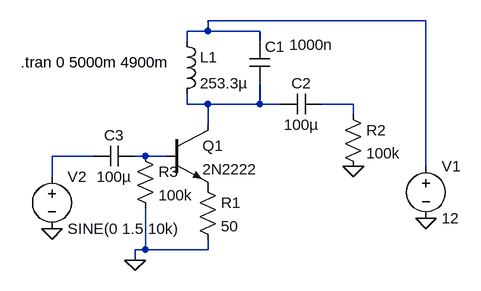
[diagram p0: schematic claseC.asc]
claseC.asc, the LTspice schematic file:
Version 4
SHEET 1 880 680
WIRE 560 -16 224 -16
WIRE 224 0 224 -16
WIRE 224 0 192 0
WIRE 304 0 224 0
WIRE 192 16 192 0
WIRE 304 16 304 0
WIRE 192 112 192 96
WIRE 224 112 192 112
WIRE 304 112 304 80
WIRE 304 112 224 112
WIRE 336 112 304 112
WIRE 448 112 400 112
WIRE 448 128 448 112
WIRE 224 144 224 112
WIRE 48 192 -16 192
WIRE 128 192 112 192
WIRE 160 192 128 192
WIRE 560 208 560 -16
WIRE -16 224 -16 192
WIRE 128 336 128 272
WIRE 128 336 112 336
WIRE 224 336 224 320
WIRE 224 336 128 336
WIRE 112 352 112 336
FLAG 112 352 0
FLAG 560 288 0
FLAG 448 208 0
FLAG -16 304 0
DATAFLAG 320 112 ""
SYMBOL npn 160 144 R0
SYMATTR InstName Q1
SYMATTR Value 2N2222
SYMBOL voltage 560 192 R0
WINDOW 123 0 0 Left 0
WINDOW 39 0 0 Left 0
SYMATTR InstName V1
SYMATTR Value 12
SYMBOL ind 176 0 R0
SYMATTR InstName L1
SYMATTR Value 253.3µ
SYMBOL cap 288 16 R0
WINDOW 3 62 5 Left 2
SYMATTR Value 1000n
SYMATTR InstName C1
SYMBOL cap 400 96 R90
WINDOW 0 0 32 VBottom 2
WINDOW 3 32 32 VTop 2
SYMATTR InstName C2
SYMATTR Value 100µ
SYMBOL res 432 112 R0
SYMATTR InstName R2
SYMATTR Value 100k
SYMBOL voltage -16 208 R0
WINDOW 123 0 0 Left 0
WINDOW 39 0 0 Left 0
SYMATTR InstName V2
SYMATTR Value SINE(0 1.5 10k)
SYMBOL res 208 224 R0
SYMATTR InstName R1
SYMATTR Value 50
SYMBOL cap 112 176 R90
WINDOW 0 0 32 VBottom 2
WINDOW 3 32 32 VTop 2
SYMATTR InstName C3
SYMATTR Value 100µ
SYMBOL res 112 176 R0
SYMATTR InstName R3
SYMATTR Value 100k
TEXT -64 48 Left 2 !.tran 0 5000m 4900m

The netlist it stands for:
* claseC.asc
Q1 N002 N005 P001 0 2N2222
V1 N001 0 12
L1 N001 N002 253.3µ
C1 N001 N002 1000n
C2 N003 N002 100µ
R2 N003 0 100k
V2 N004 0 SINE(0 1.5 10k)
R1 P001 0 50
C3 N005 N004 100µ
R3 N005 0 100k
.model NPN NPN
.model PNP PNP
.lib standard.bjt
.tran 0 5000m 4900m
.backanno
.end